# Altium schematic sheet Transmitter.SchDoc
size A4; SheetNumber: 1; SheetTotal: 1
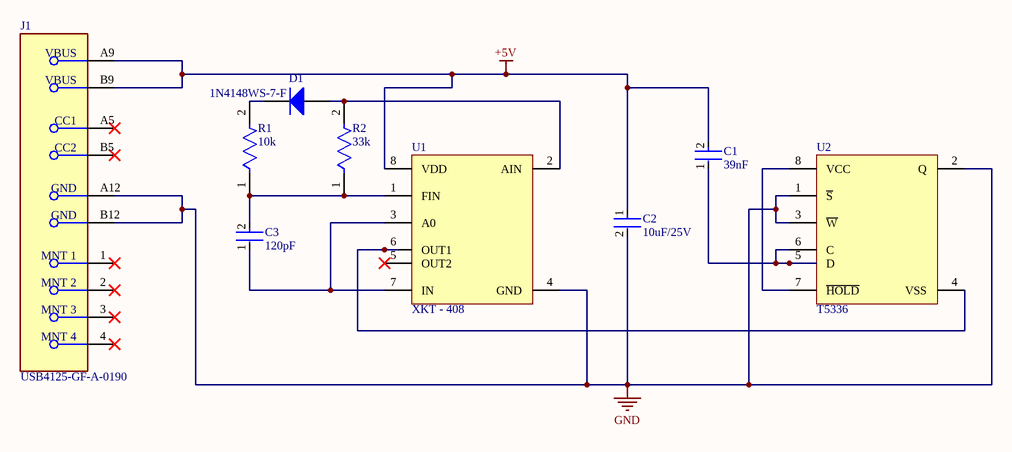
[diagram p0: Transmitter.SchDoc]

## Parts
C1  39nF  [FP-GRM15-MFG]
C2  10uF/25V  [FP-0603-L_1_6_0_15-W_0_81-IPC_A]
C3  120pF  [FP-GRM15-MFG]
D1  1N4148WS-7-F  [DIOD-SOD323-2-A_V]
J1  USB4125-GF-A-0190  [FP-USB4125-GF-A-0190-MFG]
R1  10k  [FP-ERJ2RK-IPC_A]
R2  33k  [FP-ERJ2RK-IPC_A]
U1  XKT - 408  [SOP127P600X173-8_PRSP0008DF-B_N]
U2  T5336  [SOP127P600X173-8_PRSP0008DF-B_N]

## Nets
+5V: C1.2 C2.1 J1.A9(VBUS) J1.B9(VBUS) U1.8(VDD)
GND: C2.2 J1.A12(GND) J1.B12(GND) U1.4(GND) U2.1(~{S}) U2.2(Q) U2.3(~{W})
NetC1_1: C1.1 U2.5(D) U2.6(C)
NetC3_1: C3.1 U1.3(A0) U1.7(IN)
NetC3_2: C3.2 R1.1 R2.1 U1.1(FIN)
NetD1_1: D1.1(A) R2.2 U1.2(AIN)
NetD1_2: D1.2(K) R1.2
NetU1_6: U1.6(OUT1) U2.4(VSS)
NetU2_7: U2.7(~{HOLD}) U2.8(VCC)

Not connected (* = marked no-connect by the designer): J1 1(MNT_1)* 2(MNT_2)* 3(MNT_3)* 4(MNT_4)* A5(CC1)* B5(CC2)*; U1 5(OUT2)*

## Library data of the parts
C1 C3 = CMP-2100-03641-2: CAP CER 0.1UF 16V X7R 0402; Manufacturer Part Number: GRM155R71C104KA88D; Manufacturer: Murata; Standoff Height: 0mm; Tolerance: 10%; Voltage Rating: 16Vdc; Material: Ceramic; Capacitance: 0.10μF; Value: 0.10μF; RoHS: TRUE; Temperature Characteristic: X7R; Octopart: https://octopart.com/grm155r71c104ka88d-murata-196880; Digikey Description: CAP CER 0.1UF 16V X7R 0402; Device Class L3: Ceramic Capacitors; Height: 0.55mm; ComponentLink2Description: Datasheet; Temperature Range Low: -55°C; Ipc Land Pattern Name: CAPC10050X219; ComponentLink2URL: https://search.murata.co.jp/Ceramy/image/img/A01X/G101/ENG/GRM155R71H471KA01-01A.pdf; Device Class L1: Passive Components; Lead Free: yes; Category: Cap; Package: GRM15; Temperature: -55°C to +125°C; Device Class L2: Capacitors; Temperature Range High: +125°C; Mouser Description: 0402 0.1 uF 16V ±10 % Tolerance X7R SMT Multilayer Ceramic Capacitor
C2 = CMP-2006-04378-2: General Purpose Ceramic Capacitor, 0603, 1nF, 10%, X7R, 15%, 50V; Case Code (Metric): 1608; Min Operating Temperature: -55°C; Weight: 7.1E-05oz; Series: -; Capacitance: 1nF; RoHS Compliant: Yes; Radiation Hardening: No; Height: 0.9mm; Mount: Surface Mount; REACH SVHC: No SVHC; Lead Free: Lead Free; Depth: 0.81mm; Voltage: 50V; Number of Pins: 2; Voltage Rating: 50V; Max Operating Temperature: 125°C; Termination: SMD/SMT; Construction: Flat; Case Code (Imperial): 0603; Dielectric: X7R; Width: 0.032inch; Tolerance: 10%; Case/Package: 0603; Contact Plating: Tin; Packaging: Tape and Reel; Voltage Rating (DC): 50V; Dielectric Material: Ceramic; Package Quantity: 4000; Thickness: 0.035inch; Length: 1.6mm
D1 = CMP-1667-00004-1: Fast Switching Diode, 75 V, 0.3 A, -65 to 150 degC, 2-Pin SOD323, RoHS, Tape and Reel; DatasheetVersion: Rev. 25-2, 03/2016; PackageDescription: 2-Pin Small Outline Diode, Body 1.7 x 1.3 mm; ComponentLink2Description: Datasheet; ComponentLink1URL: http://www.diodes.com/; PackageReference: SOD323-2; ComponentLink2URL: http://www.diodes.com/datasheets/ds30097.pdf; ComponentLink1Description: Manufacturer URL
J1 = CMP-245163-000004-1: CONN RCPT TYPE C 6P SMD RA
R1 R2 = CMP-1011-00415-3: RES SMD 150 OHM 1% 1/10W 0402; Resistance: 150R; Voltage Rating: 50V; Power Rating: 100mW; Temperature Coefficient: 100ppm/°C; Mount: Surface Mount; Tolerance: 1%; Height: 0.35mm; Resistance Tolerance: 1%; Package Quantity: 1; REACH SVHC: No SVHC; Number of Terminations: 2; Number of Pins: 2; Length: 1mm; Size Code: 0402; Min Operating Temperature: -55°C; Features: Automotive AEC-Q200; Contact Plating: Tin; Voltage Rating (DC): 50V; Series: ERJ; Depth: 0.5mm; Case Code (Metric): 1005; Case/Package: 0402; Construction: Rectangular; RoHS Compliant: Yes; Case Code (Imperial): 0402; Packaging: Tape and Reel; Max Operating Temperature: 155°C; Termination: SMD/SMT; Radiation Hardening: No; Lead Free: Lead Free; Military Standard: Not; Technology: THICK FILM; Width: 0.02inch; Max Power Dissipation: 100mW; Resistor Type: Thick Film
U1 U2 = CMP-00572-21273503-1: Serial Peripheral Interface 32k EEPROM (4-kword × 8-bit) 64k EEPROM (8-kword × 8-bit); Manufacturer Lifecycle Status: ACTIVE; Interface: SPI; Clock Rate: 3MHz; Frequency: 5MHz; Memory Size: 64kB; Min Input Voltage: 1.8V; Max Input Voltage: 5.5V; ComponentLink3Description: Manufacturer's Package Drawing; Length: 5mm; ComponentLink1Description: Manufacturer's Website; Mount: Surface Mount; Lead Free: Lead Free; ComponentLink3URL: https://www.renesas.com/en/document/psc/package-drawing-sop-8pin-prsp0008df-b; HelpURL: https://octopart.com/cad-content/api/get-model-datasheet/15189/21273503; Min Operating Temperature: -40°C; Lifecycle Status: Production; Number of Pins: 8; Case/Package: SOP; Packaging: Tape & Reel (TR); Height: 1.73mm; RoHS: Compliant; Width: 4mm; ComponentLink2URL: https://octopart.com/cad-content/api/get-model-datasheet/15189/21273503; ComponentLink2Description: Datasheet URL; China RoHS: Compliant; Memory Type: EEPROM; ComponentLink1URL: http://www.renesas.com; Min Supply Voltage: 1.8V; Max Supply Voltage: 5.5V; Max Operating Temperature: 85°C